# Altium schematic sheet УШЯИ.467444.130Э3_5.SchDoc
size 420 x 297 mm; SheetNumber: 5; SheetTotal: 5
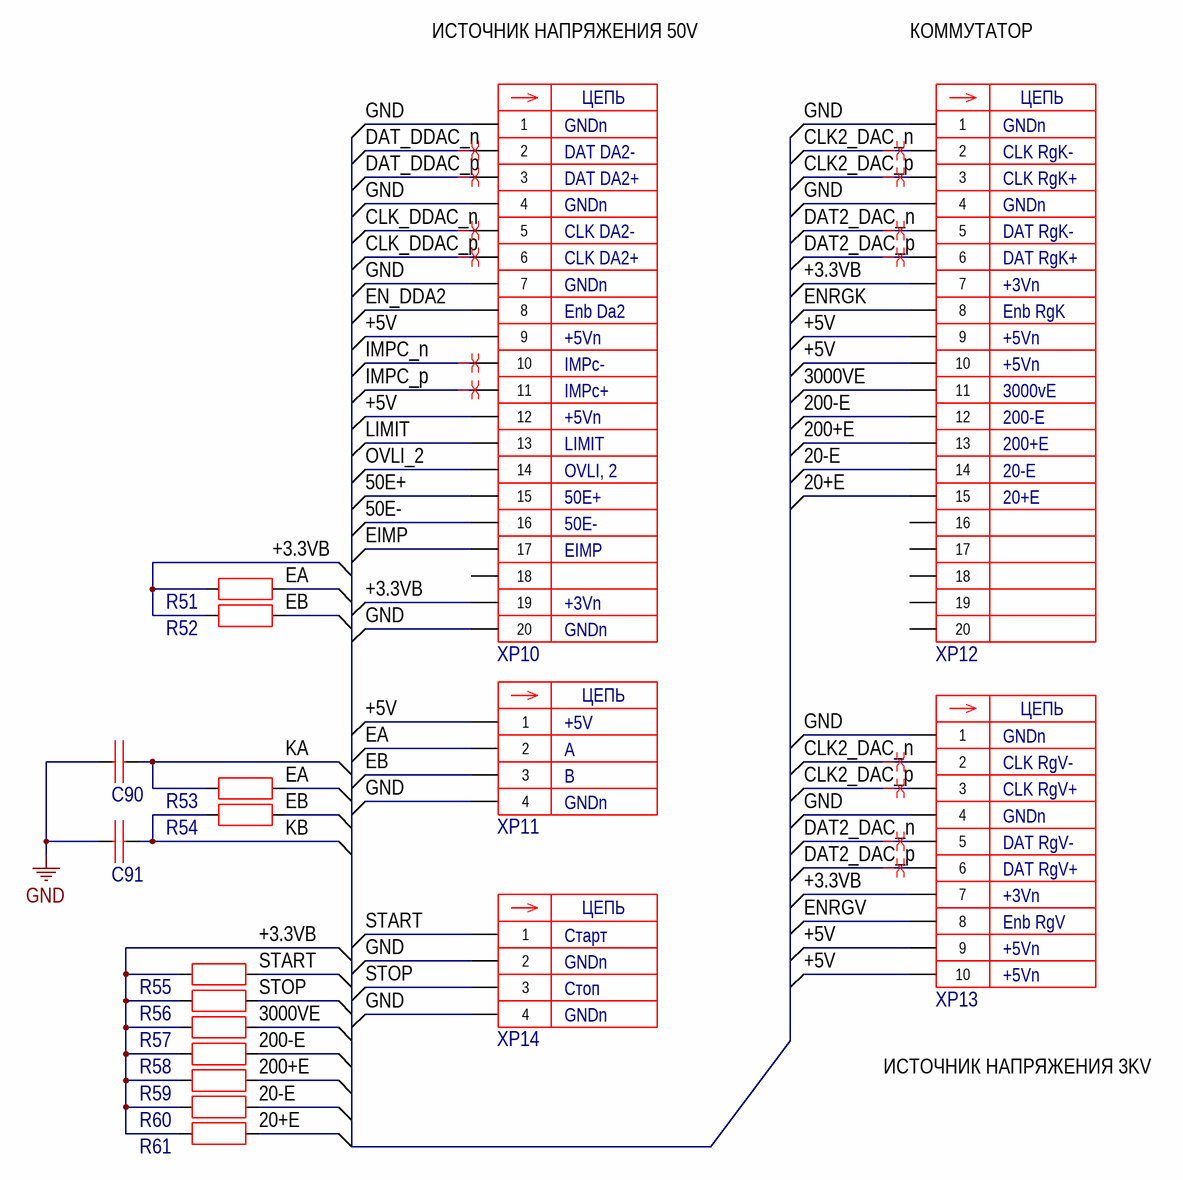
[diagram p0: УШЯИ.467444.130Э3_5.SchDoc]

## Parts
C90  0,1 µF  [C_0805 [2012 Metric]]  (value not drawn)
C91  0,1 µF  [C_0805 [2012 Metric]]  (value not drawn)
R51  10k  [R_0805 [2012 Metric]]  (value not drawn)
R52  10k  [R_0805 [2012 Metric]]  (value not drawn)
R53  10k  [R_0805 [2012 Metric]]  (value not drawn)
R54  10k  [R_0805 [2012 Metric]]  (value not drawn)
R55  10k  [R_0805 [2012 Metric]]  (value not drawn)
R56  10k  [R_0805 [2012 Metric]]  (value not drawn)
R57  10k  [R_0805 [2012 Metric]]  (value not drawn)
R58  10k  [R_0805 [2012 Metric]]  (value not drawn)
R59  10k  [R_0805 [2012 Metric]]  (value not drawn)
R60  10k  [R_0805 [2012 Metric]]  (value not drawn)
R61  10k  [R_0805 [2012 Metric]]  (value not drawn)
XP10  BH2-20R  [BH2-20R]  (value not drawn)
XP11  AMPMODU II 280371-2  [AMP II-280371-2]  (value not drawn)
XP12  BH2-20R  [BH2-20R]  (value not drawn)
XP13  BH2-10R  [BH2-10R]  (value not drawn)
XP14  AMPMODU II 280371-2  [AMP II-280371-2]  (value not drawn)

## Nets
GND: C90.2 C91.2 XP10.1 XP10.4 XP10.7 XP10.20 XP11.4 XP12.1 XP12.4 XP13.1 XP13.4 XP14.2 XP14.4
20+E: R61.2 XP12.15
20-E: R60.2 XP12.14
50E+: XP10.15
50E-: XP10.16
200+E: R59.2 XP12.13
200-E: R58.2 XP12.12
3000VE: R57.2 XP12.11
+3.3VB: R51.1 R52.1 R55.1 R56.1 R57.1 R58.1 R59.1 R60.1 R61.1 XP10.19 XP12.7 XP13.7
+5V: XP10.9 XP10.12 XP11.1 XP12.9 XP12.10 XP13.9 XP13.10
CLK2_DAC_n: XP12.2 XP13.2
CLK2_DAC_p: XP12.3 XP13.3
CLK_DDAC_n: XP10.5
CLK_DDAC_p: XP10.6
DAT2_DAC_n: XP12.5 XP13.5
DAT2_DAC_p: XP12.6 XP13.6
DAT_DDAC_n: XP10.2
DAT_DDAC_p: XP10.3
EA: R51.2 R53.2 XP11.2
EB: R52.2 R54.2 XP11.3
EIMP: XP10.17
EN_DDA2: XP10.8
ENRGK: XP12.8
ENRGV: XP13.8
IMPC_n: XP10.10
IMPC_p: XP10.11
KA: C90.1 R53.1
KB: C91.1 R54.1
LIMIT: XP10.13
OVLI_2: XP10.14
START: R55.2 XP14.1
STOP: R56.2 XP14.3

Not connected (* = marked no-connect by the designer): XP10 18; XP12 16 17 18 19 20

## Layout directives
differential pair: CLK2_DAC_n, CLK2_DAC_p, CLK_DDAC_n, CLK_DDAC_p, DAT2_DAC_n, DAT2_DAC_p, DAT_DDAC_n, DAT_DDAC_p, IMPC_n, IMPC_p

## Notes on the sheet
- ИСТОЧНИК НАПРЯЖЕНИЯ 50V
- КОММУТАТОР
- GNDn
- DAT DA2-
- CLK RgK-
- DAT DA2+
- CLK DA2-
- CLK RgK+
- DAT RgK-
- CLK DA2+
- Enb Da2
- DAT RgK+
- +3Vn
- Enb RgK
- +5Vn
- IMPc-
- IMPc+
- LIMIT
- 3000vE
- 200-E
- 200+E
- OVLI, 2
- 50E+
- 20-E
- 20+E
- 50E-
- EIMP
- +5V
- A
- B
- CLK RgV-
- CLK RgV+
- DAT RgV-
- DAT RgV+
- Старт
- Enb RgV
- Стоп
- ИСТОЧНИК НАПРЯЖЕНИЯ 3KV
- Подп. дата
- Инв. № дубл.
- Взам. инв. №
- Подп. и дата
- Инв. № подл.
- Изм.
- Лист
- № докум.
- Подп.
- Дата
- ALTIUM GOSTBOM2.0 KEV
- Файл:
- Копировал
- Формат А3
- (in symbol Conn_3) ЦЕПЬ
- (in symbol Conn_31) ЦЕПЬ
- (in symbol Conn_32) ЦЕПЬ

## Library data of the parts
C90 C91 = Cap_60: Неполярный конденсатор; Manufacturer: Murata; ID: Cap_60; Component Name: Конденсатор GRM21BR71H104KA01L; Voltage: 50V; Tolerance: ±10%; Datasheet: https://www.murata.com/en-eu/products/productdetail?partno=GRM21BR71H104KA01%23; Capacitance: 0,1 µF; Case / Package: 0805 [2012 Metric]; Height: 1.4mm; Weight, kg: 0,000006
R51-R61 = Res_57: ID: Res_57; Component Name: Резистор 0805-10 кОм ±1%; Tolerance: ±1%; Resistance: 10k; Height: 0.7mm; Weight, kg: 0,000006; Case / Package: 0805 [2012 Metric]
XP10 XP12 = Conn_31: Male, 20 pins, 2 rows, Right Angle, DS1014-20RF1B-B, 2 mm; Manufacturer: Connfly electronic; Component Name: Вилка BH2-20R; Catalogue: ChipDip 8027300167; Крепёж: Не нужно; ID: Conn_31; Device: BH2-20R; Datasheet: https://static.chipdip.ru/lib/525/DOC059525726.pdf; Height: 5.6mm; Weight, kg: 0,0016
XP11 XP14 = Conn_3: Male, 4 pin, 1 row, Vertical, Board-to-Board, 2.54 mm; Manufacturer: TE Connectivity; ID: Conn_3; Component Name: Вилка AMPMODU II 280371-2; Catalogue: TE Internal 280371-2; Крепёж: Не нужно; Device: AMPMODU II 280371-2; Datasheet: https://www.te.com/usa-en/product-280371-2.datasheet.pdf; Height: 12.8mm; Weight, kg: 0,001
XP13 = Conn_32: Male, 10 pins, 2 rows, Vertical, DS1014-10RF1B-B, 2 mm; Manufacturer: Connfly electronic; Component Name: Вилка BH2-10R; Catalogue: ChipDip 8144058573; Крепёж: Не нужно; ID: Conn_32; Device: BH2-10R; Datasheet: https://static.chipdip.ru/lib/525/DOC059525726.pdf; Height: 5.6mm; Weight, kg: 0,00071